# EAGLE design fb_relais_8_230V_83c_1_lagig (EAGLE 5.06)
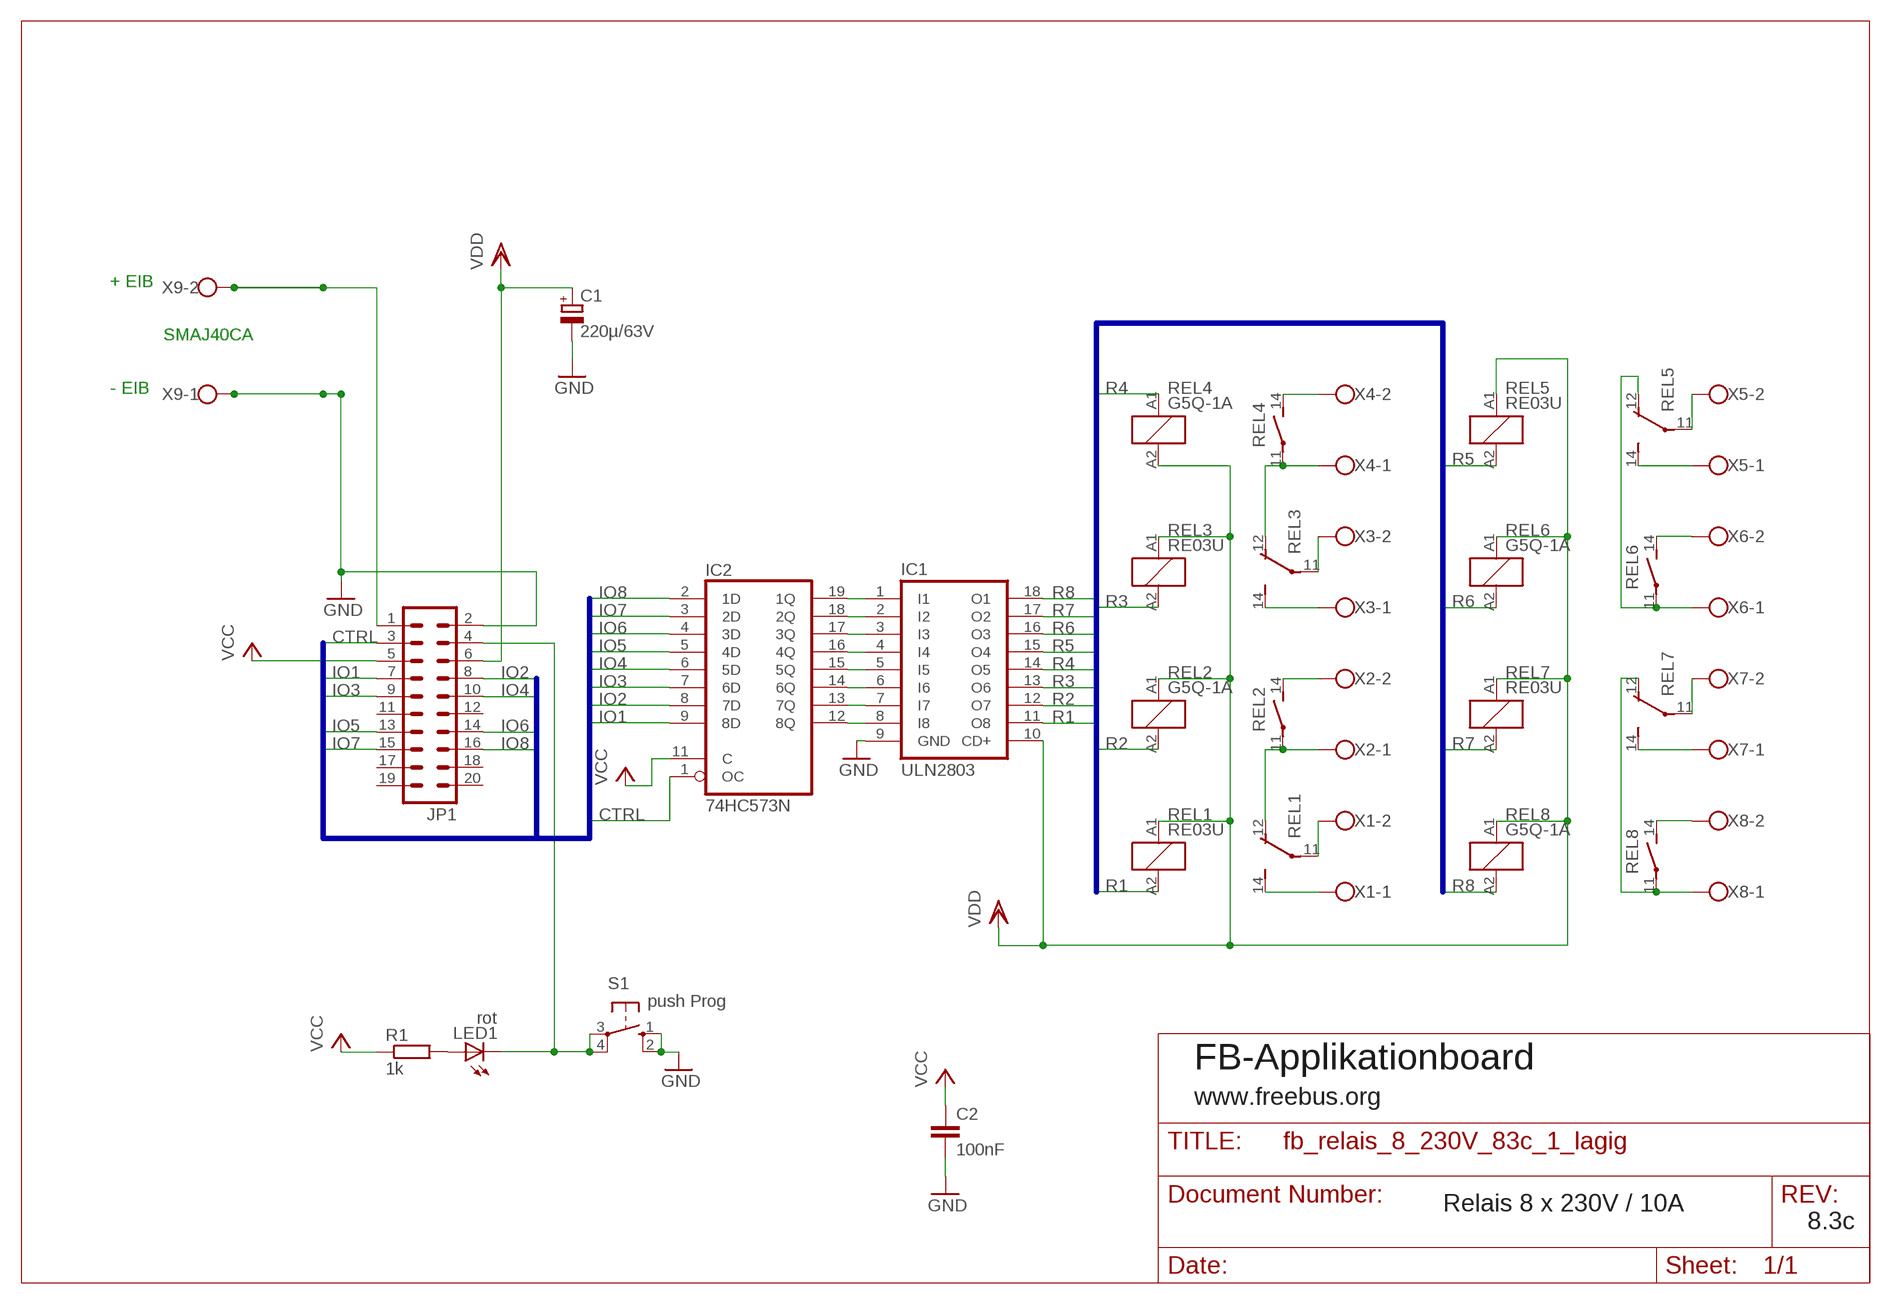
[diagram p0: schematic, sheet 1]

## Parts
C1  220µ/63V  CPOL-EUE5-10.5  [E5-10,5]
C2  100nF  C-EU050-024X044  [C050-024X044]
IC1  ULN2803  ULN2803A  [DIL18]
IC2  74HC573N  [DIL20]
JP1  ML20  [ML20]
LED1  rot  LED3MM  [LED3MM]
R1  1k  R-EU_0207/10  [0207/10]
REL1  RE03U  [G5Q_1_EU]
REL2  G5Q-1A  RE030024  [RE-SCHRACK]
REL3  RE03U  [G5Q_1_EU]
REL4  G5Q-1A  RE030024  [RE-SCHRACK]
REL5  RE03U  [G5Q_1_EU]
REL6  G5Q-1A  RE030024  [RE-SCHRACK]
REL7  RE03U  [G5Q_1_EU]
REL8  G5Q-1A  RE030024  [RE-SCHRACK]
S1  push Prog  10-XX  [B3F-10XX]
X1  W237-102  [W237-102]
X2  W237-102  [W237-102]
X3  W237-102  [W237-102]
X4  W237-102  [W237-102]
X5  W237-102  [W237-102]
X6  W237-102  [W237-102]
X7  W237-102  [W237-102]
X8  W237-102  [W237-102]
X9  W237-102  [W237-102]

## Nets
CTRL: IC2.1(OC) JP1.3
GND: C1.- C2.2 IC1.9(GND) JP1.2 S1.1(S) S1.2(S1) X9.1
IO1: IC2.9(8D) JP1.7
IO2: IC2.8(7D) JP1.8
IO3: IC2.7(6D) JP1.9
IO4: IC2.6(5D) JP1.10
IO5: IC2.5(4D) JP1.13
IO6: IC2.4(3D) JP1.14
IO7: IC2.3(2D) JP1.15
IO8: IC2.2(1D) JP1.16
N$1 [230Vac]: REL2.14(2:S) X2.2
N$2 [230Vac]: REL3.12(14:O) REL4.11(2:P) X4.1
N$3 [230Vac]: REL3.14(14:S) X3.1
N$4 [230Vac]: REL3.11(14:P) X3.2
N$5 [230Vac]: REL8.14(2:S) X8.2
N$6 [230Vac]: REL1.12(14:O) REL2.11(2:P) X2.1
N$7 [230Vac]: REL1.14(14:S) X1.1
N$8 [230Vac]: REL1.11(14:P) X1.2
N$9 [230Vac]: REL5.12(14:O) REL6.11(2:P) X6.1
N$11 [230Vac]: REL7.11(14:P) X7.2
N$12 [230Vac]: REL6.14(2:S) X6.2
N$13 [230Vac]: REL5.11(14:P) X5.2
N$14 [230Vac]: REL5.14(14:S) X5.1
N$15 [230Vac]: REL7.14(14:S) X7.1
N$16 [230Vac]: REL7.12(14:O) REL8.11(2:P) X8.1
N$20: JP1.1 X9.2
N$27: JP1.4 LED1.K(C) S1.3(P) S1.4(P1)
N$28: LED1.A R1.2
N$30: IC1.1(I1) IC2.19(1Q)
N$31: IC1.2(I2) IC2.18(2Q)
N$32: IC1.3(I3) IC2.17(3Q)
N$33: IC1.4(I4) IC2.16(4Q)
N$34: IC1.5(I5) IC2.15(5Q)
N$36: IC1.6(I6) IC2.14(6Q)
N$37: IC1.7(I7) IC2.13(7Q)
N$38: IC1.8(I8) IC2.12(8Q)
N$39 [230Vac]: REL4.14(2:S) X4.2
R1: IC1.11(O8) REL1.A2
R2: IC1.12(O7) REL2.A2
R3: IC1.13(O6) REL3.A2
R4: IC1.14(O5) REL4.A1
R5: IC1.15(O4) REL5.A2
R6: IC1.16(O3) REL6.A2
R7: IC1.17(O2) REL7.A2
R8: IC1.18(O1) REL8.A2
VCC: C2.1 IC2.11(C) JP1.5 R1.1
VDD: C1.+ IC1.10(CD+) JP1.6 REL1.A1 REL2.A1 REL3.A1 REL4.A2 REL5.A1 REL6.A1 REL7.A1 REL8.A1
Unconnected: JP1.11 JP1.12 JP1.17 JP1.18 JP1.19 JP1.20

## Buses
R[1..8]
IO[1..8],CTRL

## Notes on the sheet
- + EIB
- SMAJ40CA
- - EIB
- FB-Applikationboard
- www.freebus.org
- Relais 8 x 230V / 10A
- 8.3c

## Power pins joined to a net without a drawn wire
GND: IC2.10(GND)
VCC: IC2.20(VCC)

## Library data of the parts
C1 = rcl:CPOL-EU: POLARIZED CAPACITOR, European symbol
C2 = rcl:C-EU: CAPACITOR, European symbol
IC1 = uln-udn:ULN2803A: DRIVER ARRAY
IC2 = 74xx-eu:74*573: 8-bit D latch BUS DRIVER
JP1 = con-harting-ml:ML20: HARTING
LED1 = led:LED: LED OSRAM: - CHIPLED LG R971, LG N971, LY N971, LG Q971, LY Q971, LO R971, LY R971 LH N974, LH R974 LS Q976, LO Q976, LY Q976 LO Q996 - Hyper CHIPLED LW Q18S LB Q993, LB Q99A, LB R99A - SideLED LS A670, LO A670, LY A670, LG A670, LP A670 LB A673, LV A673, LT A673, LW A673 LH A674 LY A675 LS A676, LA A676, LO A676, LY A676, LW A676 LS A679, LY A679, LG A679 - Hyper Micro SIDELED® LS Y876, LA Y876, LO Y876, LY Y876 LT Y87S - SmartLED LW L88C, LW L88S LB L89C, LB L89S, LG L890 LS L89K, LO L89K, LY L89K LS L896, LA L896, LO L896, LY L896 - TOPLED LS T670, LO T670, LY T670, LG T670, LP T670 LSG T670, LSP T670, LSY T670, LOP T670, LYG T670 LG T671, LOG T671, LSG T671 LB T673, LV T673, LT T673, LW T673 LH T674 LS T676, LA T676, LO T676, LY T676, LB T676, LH T676, LSB T676, LW T676 LB T67C, LV T67C, LT T67C, LS T67K, LO T67K, LY T67K, LW E67C LS E67B, LA E67B, LO E67B, LY E67B, LB E67C, LV E67C, LT E67C LW T67C LS T679, LY T679, LG T679 LS T770, LO T770, LY T770, LG T770, LP T770 LB T773, LV T773, LT T773, LW T773 LH T774 LS E675, LA E675, LY E675, LS T675 LS T776, LA T776, LO T776, LY T776, LB T776 LHGB T686 LT T68C, LB T68C - Hyper Mini TOPLED® LB M676 - Mini TOPLED Santana® LG M470 LS M47K, LO M47K, LY M47K Source: http://www.osram.convergy.de - LUMILED® LXK2-PW12-R00, LXK2-PW12-S00, LXK2-PW14-U00, LXK2-PW14-V00 LXK2-PM12-R00, LXK2-PM12-S00, LXK2-PM14-U00 LXK2-PE12-Q00, LXK2-PE12-R00, LXK2-PE12-S00, LXK2-PE14-T00, LXK2-PE14-U00 LXK2-PB12-K00, LXK2-PB12-L00, LXK2-PB12-M00, LXK2-PB14-N00, LXK2-PB14-P00, LXK2-PB14-Q00 LXK2-PR12-L00, LXK2-PR12-M00, LXK2-PR14-Q00, LXK2-PR14-R00 LXK2-PD12-Q00, LXK2-PD12-R00, LXK2-PD12-S00 LXK2-PH12-R00, LXK2-PH12-S00 LXK2-PL12-P00, LXK2-PL12-Q00, LXK2-PL12-R00 Source: www.luxeon.com
R1 = rcl:R-EU_: RESISTOR, European symbol
REL1 REL3 REL5 REL7 = freebus_relay:RE03U
REL2 REL4 REL6 REL8 = relay:RE03*: Miniature PCB Relay 1 pole 6 A SCHRACK Source: http://www.schrack.com/.. 5812.pdf
S1 = switch-omron:10-XX: OMRON SWITCH
X1-X9 = con-wago-500:W237-102: WAGO SCREW CLAMP

## Net classes
0 SELV: width 0.406 mm
1 230Vac: width 1.93 mm, clearance 5.08 mm to class 0, clearance 1.905 mm

## Board
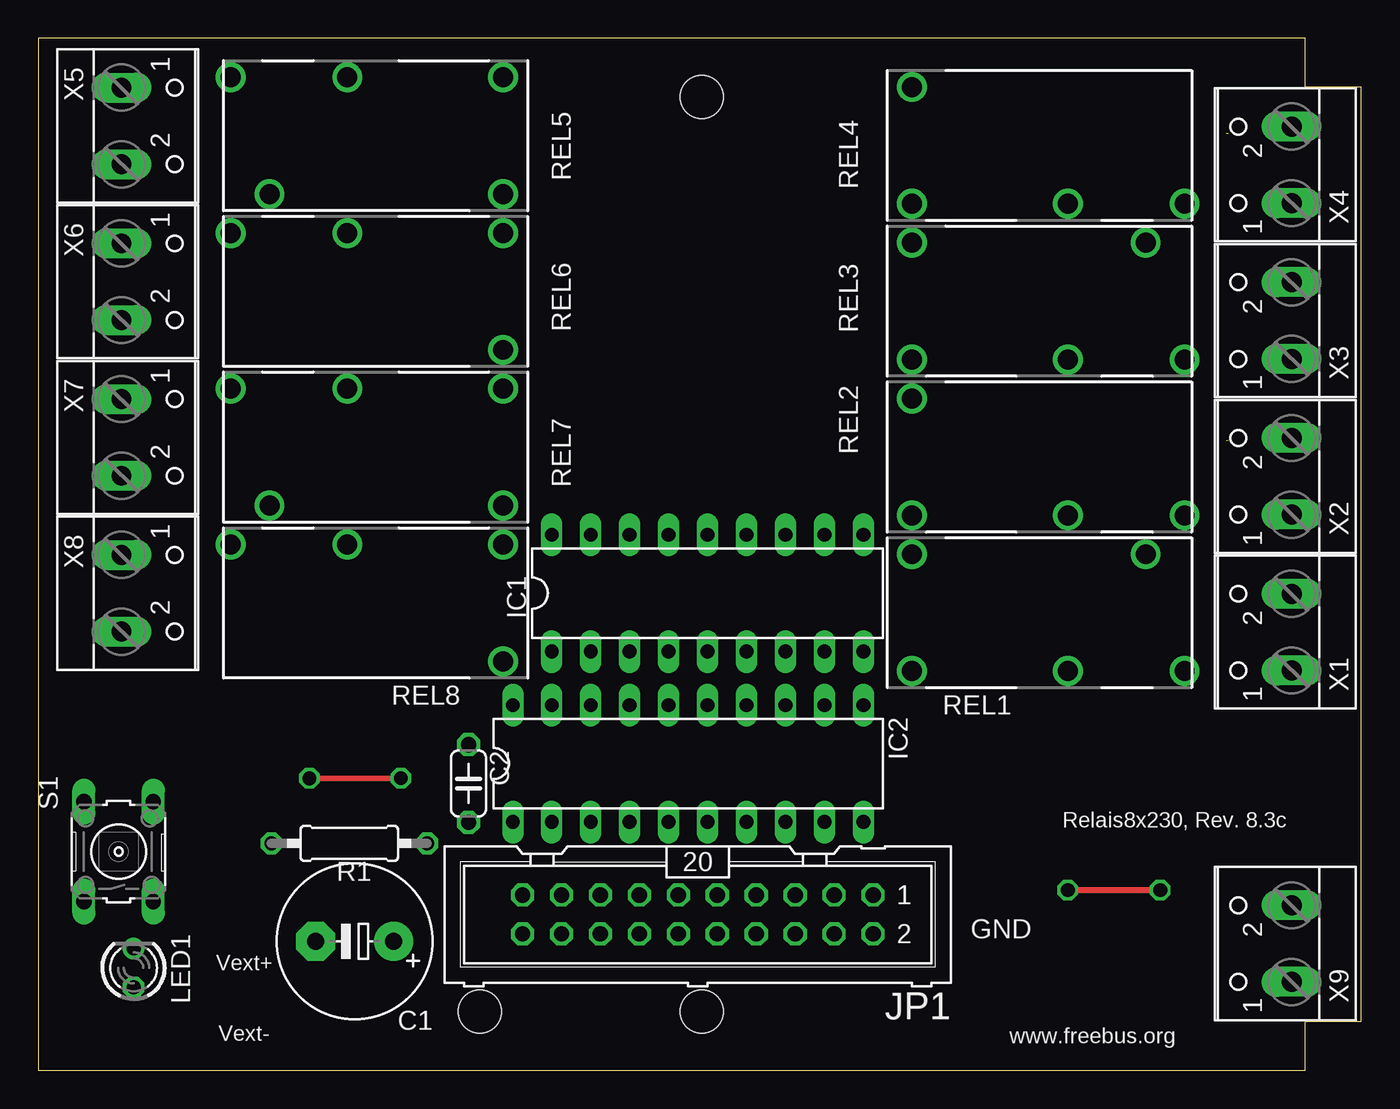
[diagram p1: board, top side]
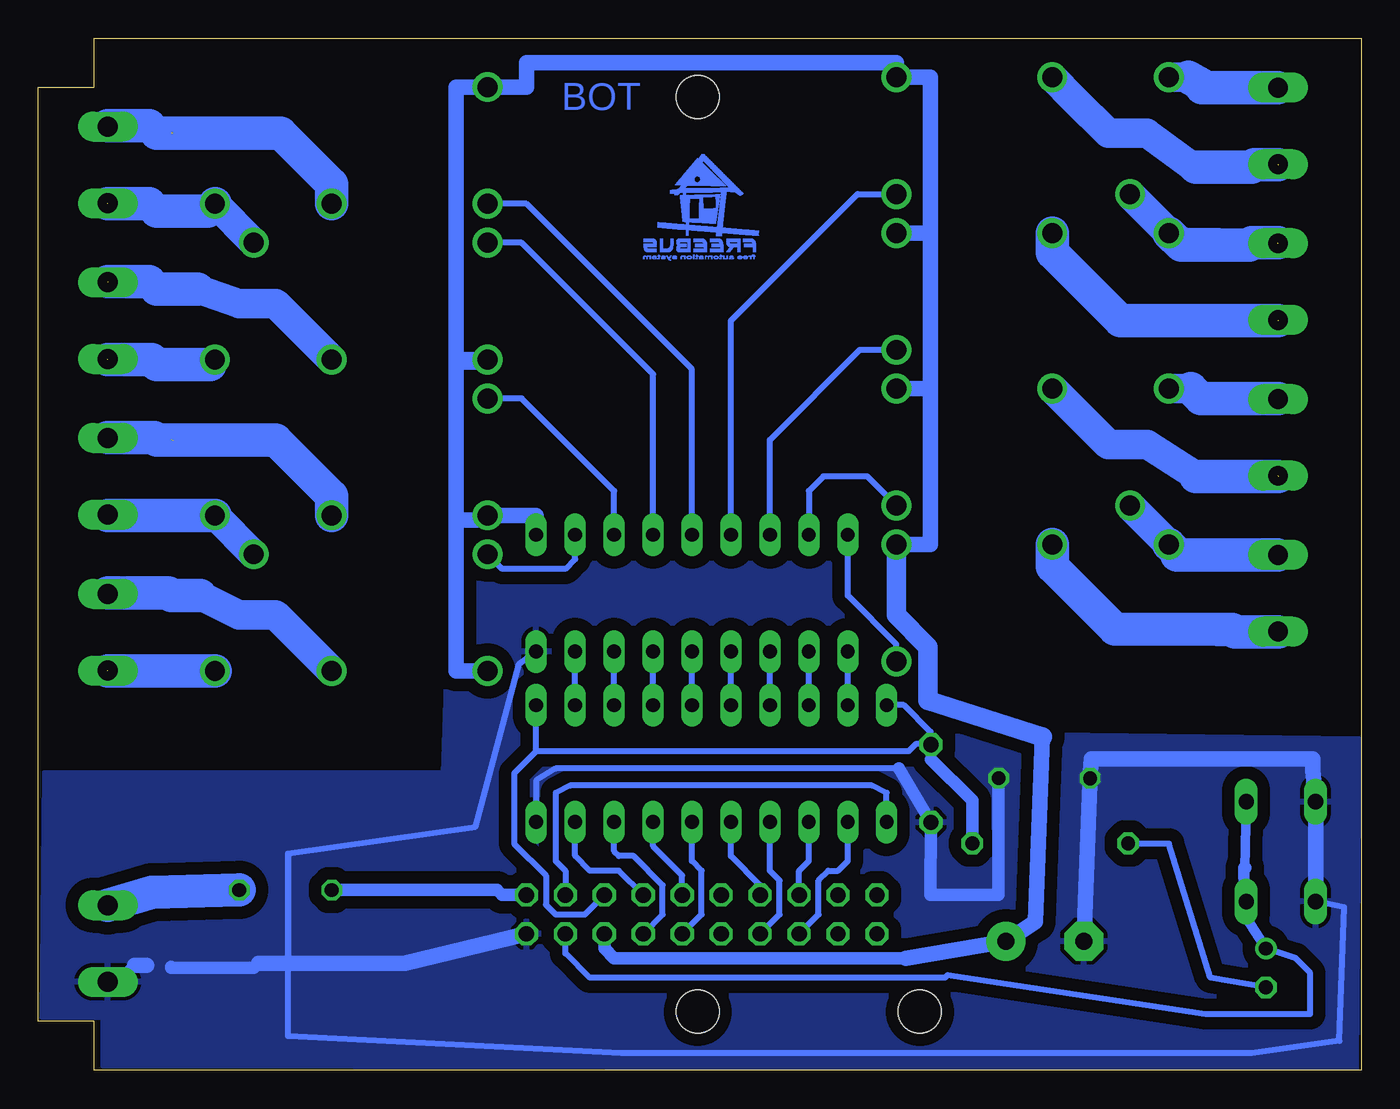
[diagram p2: board, bottom side, seen from below]

Size 86.28 x 67.31 mm. Coordinates in mm from the lower left corner, seen from the top.
Outline: 0,0.01 82.64,0 82.64,3.18 86.28,3.18 86.28,64.13 82.64,64.13 82.64,67.31 0,67.31 0,0.01
Copper layers (1*16): Top 0.035mm / dielectric 1.5mm / Bottom 0.035mm
Design rules "0.35mm": minimum track width 10mil, minimum drill 24mil, track to track 0.35mm, track to pad 0.35mm, pad to pad 0.35mm, via to via 0.35mm, smd to smd 0.35mm, copper to edge 0mil, drill to drill 8mil, minimum pad ring 10mil, minimum via ring 8mil, stop-mask expansion 4mil, vias tented up to drill 0mil, thermal gap 10mil
Holes 2.8 mm at 43.27,3.81 43.27,63.5 28.79,3.81

### Footprints (pad centres in the part's own frame; a part is rotated, then mirrored left to right if it is on the bottom)
E5-10,5 = drill 1.1 pad 2.54 round: + -2.54,0 | drill 1.1 pad 2.54 octagon: - 2.54,0
C050-024X044 = drill 1 octagon: 1 -2.54,0; 2 2.54,0
DIL18 = drill 0.9 long: 1 -10.16,-3.81; 2 -7.62,-3.81; 3 -5.08,-3.81; 4 -2.54,-3.81; 5 0,-3.81; 6 2.54,-3.81; 7 5.08,-3.81; 8 7.62,-3.81; 9 10.16,-3.81; 10 10.16,3.81; 11 7.62,3.81; 12 5.08,3.81; 13 2.54,3.81; 14 0,3.81; 15 -2.54,3.81; 16 -5.08,3.81; 17 -7.62,3.81; 18 -10.16,3.81
DIL20 = drill 0.9 long: 1 -11.43,-3.81; 2 -8.89,-3.81; 3 -6.35,-3.81; 4 -3.81,-3.81; 5 -1.27,-3.81; 6 1.27,-3.81; 7 3.81,-3.81; 8 6.35,-3.81; 9 8.89,-3.81; 10 11.43,-3.81; 11 11.43,3.81; 12 8.89,3.81; 13 6.35,3.81; 14 3.81,3.81; 15 1.27,3.81; 16 -1.27,3.81; 17 -3.81,3.81; 18 -6.35,3.81; 19 -8.89,3.81; 20 -11.43,3.81
ML20 = drill 1 octagon: 1 -11.43,-1.27; 2 -11.43,1.27; 3 -8.89,-1.27; 4 -8.89,1.27; 5 -6.35,-1.27; 6 -6.35,1.27; 7 -3.81,-1.27; 8 -3.81,1.27; 9 -1.27,-1.27; 10 -1.27,1.27; 11 1.27,-1.27; 12 1.27,1.27; 13 3.81,-1.27; 14 3.81,1.27; 15 6.35,-1.27; 16 6.35,1.27; 17 8.89,-1.27; 18 8.89,1.27; 19 11.43,-1.27; 20 11.43,1.27
LED3MM = drill 0.9 octagon: A -1.27,0 | drill 0.9 round: K 1.27,0
0207/10 = drill 0.9 octagon: 1 -5.08,0; 2 5.08,0
G5Q_1_EU = drill 1.3 round: 11 1.27,-3.81; 12 6.35,3.81; 14 8.89,-3.81; A1 -8.89,-3.81; A2 -8.89,3.81
RE-SCHRACK = drill 1.3 round: 11 8.89,-3.81; 14 1.27,-3.81; A1 -8.89,-3.81; A2 -8.89,3.81
B3F-10XX = drill 1 long: 1 -3.251,2.261; 2 3.251,2.261; 3 -3.251,-2.261; 4 3.251,-2.261
W237-102 = drill 1.3 long: 1 -2.5,-1.27; 2 2.5,-1.27

### Placement (x,y rotation side)
C1  20.63,8.41 180 top
C2  28.06,18.7 270 top
IC1  43.65,31.11 0 top
IC2  42.38,20 0 top
JP1  43.01,10.16 180 top
LED1  6.22,6.67 90 top
R1  20.28,14.8 180 top
REL1  65.88,29.84 0 top
REL2  65.88,40.01 0 top
REL3  65.88,50.16 0 top
REL4  65.88,60.33 0 top
REL5  21.43,60.96 180 top
REL6  21.43,50.8 180 top
REL7  21.43,40.64 180 top
REL8  21.43,30.48 180 top
S1  5.23,14.26 90 top
X1  80.48,28.57 90 top
X2  80.48,38.73 90 top
X3  80.48,48.9 90 top
X4  80.48,59.05 90 top
X5  6.69,61.59 270 top
X6  6.69,51.44 270 top
X7  6.69,41.27 270 top
X8  6.69,31.11 270 top
X9  80.48,8.26 90 top

### Tracks (layer width: path | path; a pad name or v marks a point on that pad's centre or on a via)
CTRL
  Bottom 0.406: IC2.1 30.95,18.1 31.9,18.57 51.59,18.57 52.54,18.1 52.54,13.65 51.9,13.02 JP1.3
GND  (via drill 0.9)
  Top 0.406: v17.68,19.04 v23.65,19.05
  Bottom 0.406: IC2.10 53.81,18.89 52.54,19.68 30.16,19.68 | IC1.9 54.92,26.51 57.78,15.88 70,14.13 | 70,14.13 70,6.99 | 70,14.13 70,2.22 48.25,1.11 7.14,1.11 1.42,1.91 1.1,10.64 S1.1
  Bottom 0.813: 77.62,6.76 77.62,6.67 72.22,6.67 71.91,6.99 | 80,6.83 | X9.1 81.07,5.75 80,6.83 | 30.16,19.68 C2.2 28.09,11.43 23.65,11.43 v23.65,19.05
  Bottom 1.016: 80,6.83 79.21,6.83 | JP1.2 62.38,6.99 70,6.99 71.91,6.99 | S1.1 S1.2 3.17,19.57 3.17,20.32 17.61,20.32 v17.68,19.04 17.69,18.72 C1.-
  pour Bottom (isolate 0.813): 0.15,21.59 25.24,21.91 27.62,28.57 27.62,67.15 59.68,66.99 59.68,24.13 59.84,19.37 85.88,19.37 86.04,3.49 82.07,3.49 82.07,0.32 0.31,0.16
IO1
  Bottom 0.406: JP1.7 48.41,13.02 50.32,13.02 51.27,13.97 IC2.9
IO2
  Bottom 0.406: JP1.8 45.55,10.16 45.55,12.06 47.46,13.97 48.41,13.97 48.73,14.29 IC2.8
IO3
  Bottom 0.406: JP1.9 44.28,12.7 46.19,14.61 IC2.7
IO4
  Bottom 0.406: JP1.10 43.01,10.16 43.01,13.02 43.65,13.65 IC2.6
IO5
  Bottom 0.406: JP1.13 39.2,12.06 41.11,13.97 IC2.5
IO6
  Bottom 0.406: JP1.14 37.93,10.16 37.93,12.38 38.57,13.02 IC2.4
IO7
  Bottom 0.406: JP1.15 36.66,13.02 36.03,13.65 IC2.3
IO8
  Bottom 0.406: JP1.16 35.39,10.16 35.39,12.38 34.76,13.02 34.12,13.02 33.49,13.65 IC2.2
N$1  (1 unrouted)
  Bottom 1.93: 77.46,41.12 77.49,41.09 | 81.75,41.27 X2.2
  Bottom 2.184: REL2.14 67.14,37.47 70.8,41.12 77.46,41.12 | 77.62,41.12 78.57,41.12 78.73,41.27 81.75,41.27
N$2  (1 unrouted)
  Bottom 1.93: REL3.12 REL4.11
  Bottom 2.184: REL4.11 75.24,56.04 78.57,56.04 79.05,56.52 81.75,56.52
N$3  (1 unrouted)
  Bottom 1.93: REL3.14 75.08,46.04
  Bottom 2.184: 75.08,46.04 78.57,46.04 78.89,46.35 81.75,46.35
N$4  (1 unrouted)
  Bottom 1.93: REL3.11 70.8,50.01 73.18,50.01 75.88,50.96
  Bottom 2.184: 75.88,50.96 78.57,50.96 79.05,51.44 81.75,51.44
N$5
  Bottom 1.93: 5.39,28.57 X8.2
  Bottom 2.184: REL8.14 20.15,32.86 16.08,28.79 9.04,28.73 | 9.04,28.73 8.41,28.73 8.25,28.57 5.39,28.57 | 9.04,28.73 9.36,28.73
N$6
  Bottom 1.93: REL1.12 REL2.11 | 81.75,36.2 X2.1
  Bottom 2.184: REL2.11 81.75,36.2
N$7  (1 unrouted)
  Bottom 2.184: REL1.14 81.75,26.04
N$8
  Bottom 1.93: REL1.11 68.57,27.46 70.8,29.69 73.18,29.69 74.76,30.48 75.72,30.96 | 81.75,31.11 X1.2
  Bottom 2.184: 75.72,30.96 77.62,30.96 77.78,31.11 81.75,31.11
N$9  (1 unrouted)
  Bottom 1.93: REL6.11 REL5.12 | 9.36,53.92 9.36,53.98 11.58,53.98 11.74,53.82
  Bottom 2.184: 5.39,53.98 7.14,53.98 7.3,53.82 11.74,53.82 REL6.11
N$11  (1 unrouted)
  Bottom 1.93: REL7.11 16.5,40.8 13.96,40.8 10.95,38.89 10.79,38.73 | 9.36,38.73 9.36,38.75
  Bottom 2.184: 10.79,38.73 9.36,38.73 5.39,38.73
N$12  (1 unrouted)
  Bottom 2.184: REL6.14 20.15,53.34 15.71,48.9 5.39,48.9
N$13  (1 unrouted)
  Bottom 1.93: 10.79,58.88 10.94,58.88 | REL5.11 18.73,63.34 16.5,61.12 13.96,61.12 10.95,58.9 10.79,58.9 10.79,58.88 | 10.78,58.9 10.79,58.88
  Bottom 2.184: 10.78,58.9 7.14,58.9 6.98,59.05 5.39,59.05
N$14
  Bottom 1.93: 11.26,64.77 REL5.14
  Bottom 2.184: 11.26,64.77 10.22,64.2 10.38,64.09 X5.1
N$15
  Bottom 1.93: 11.11,44.45 REL7.14 | 5.39,43.81 X7.1
  Bottom 2.184: 11.11,44.45 10.47,43.81 5.39,43.81
N$16
  Bottom 1.93: REL8.11 REL7.12
  Bottom 2.184: REL8.11 12.03,33.78 12.03,33.62 X8.1
N$20  (via drill 0.9)
  Top 0.406: v67.14,11.75 v73.18,11.75
  Bottom 0.813: v73.18,11.75 73.23,11.8 | v67.14,11.75 56.35,11.75 56.03,11.43 JP1.1
  Bottom 2.184: X9.2 78.89,11.59 v73.18,11.75
N$27
  Bottom 0.406: LED1.K 4.28,7.3 3.33,6.35 3.33,3.65 10.15,3.65 26.98,6.19 27.14,6.03 50.32,6.03 51.9,7.62 JP1.4
  Bottom 0.61: 7.73,13.21 7.45,13.21 7.45,13.18 7.73,13.21 | 7.73,13.21 S1.3 | 7.65,10.2 S1.4 | 7.65,10.2 7.73,13.21 | LED1.K 7.65,10.2
N$28
  Bottom 0.406: LED1.A 9.84,6.03 12.53,14.76 15.23,14.76 R1.2 | R1.2
N$30
  Bottom 0.406: IC2.19 IC1.1
N$31
  Bottom 0.406: IC2.18 IC1.2
N$32
  Bottom 0.406: IC2.17 IC1.3
N$33
  Bottom 0.406: IC2.16 IC1.4
N$34
  Bottom 0.406: IC2.15 IC1.5
N$36
  Bottom 0.406: IC2.14 IC1.6
N$37
  Bottom 0.406: IC2.13 IC1.7
N$38
  Bottom 0.406: IC2.12 IC1.8
N$39  (1 unrouted)
  Bottom 1.93: 81.75,61.59 X4.2
  Bottom 2.184: REL4.14 67.14,57.78 70.48,61.12 77.48,61.12 | 77.62,61.12 78.57,61.12 79.05,61.59 81.75,61.59
R1
  Bottom 0.406: REL1.A2 56.03,32.7 51.9,32.7 51.27,33.34 IC1.11
R2
  Bottom 0.406: IC1.12 48.73,37.78 54.76,43.81 REL2.A2
R3
  Bottom 0.406: IC1.13 46.19,45.4 54.76,53.98 REL3.A2
R4
  Bottom 0.406: IC1.14 43.65,45.72 54.44,56.52 REL4.A1
R5
  Bottom 0.406: IC1.15 41.11,48.9 32.85,57.15 REL5.A2
R6
  Bottom 0.406: IC1.16 38.57,41.12 32.7,46.99 REL6.A2
R7
  Bottom 0.406: IC1.17 36.03,37.78 35.08,38.73 32.22,38.73 REL7.A2
R8
  Bottom 0.406: REL8.A2 30.31,27.78 33.49,30.96 IC1.18
VCC
  Bottom 0.406: JP1.5 50.63,10.16 52.54,10.16 53.17,10.79 53.17,12.7 55.24,14.76 55.24,19.37 53.81,20.8 | 30.16,20.8 | 30.16,20.8 53.81,20.8 | 30.16,20.8 | IC2.20 29.84,23.81 28.09,22.07 28.09,21.27 29.04,21.27 29.52,20.8 30.16,20.8 | C2.1 | 30.16,20.8 | 28.06,20.29 C2.1 | 53.81,20.8 IC2.11
  Bottom 0.813: C2.1 28.09,21.27 | R1.1 25.36,17.59 28.06,20.29
VDD
  Bottom 0.813: JP1.6 49.36,7.94 48.73,7.3 29.68,7.3
  Bottom 1.016: 28.09,44.45 28.09,34.29 REL8.A1 | 28.09,44.45 REL7.A1 | 28.09,44.45 28.09,54.61 | 28.09,54.61 REL6.A1 | 28.09,54.61 28.09,64.77 REL5.A1 30.31,65.72 54.44,65.72 54.44,64.14 REL4.A2 59.05,64.14 59.05,46.2 56.98,46.2 REL3.A1 59.05,46.35 59.05,35.88 | 59.05,35.88 56.98,35.88 REL2.A1 53.81,36.2 IC1.10 | REL1.A1 59.05,26.04 59.05,35.88 | 20.79,21.75 21.27,9.68 C1.+ 29.68,7.3
  Bottom 1.27: 20.79,21.75 28.25,24.13 28.25,27.62 30.31,29.69 REL8.A1
(copper drawn outside any net)
  shapes: Bottom area x3722

### Text on the board
Bottom: BOT
tPlace: Vext+ | Vext-
tNames: REL4 | Relais8x230, Rev. 8.3c | GND | www.freebus.org
Document: A5 | A4 | A6 | A3 | A7 | A2 | A8 | A1 | EIB + | EIB -